# Altium project digital_power.PrjPcb (part 1 of 2)
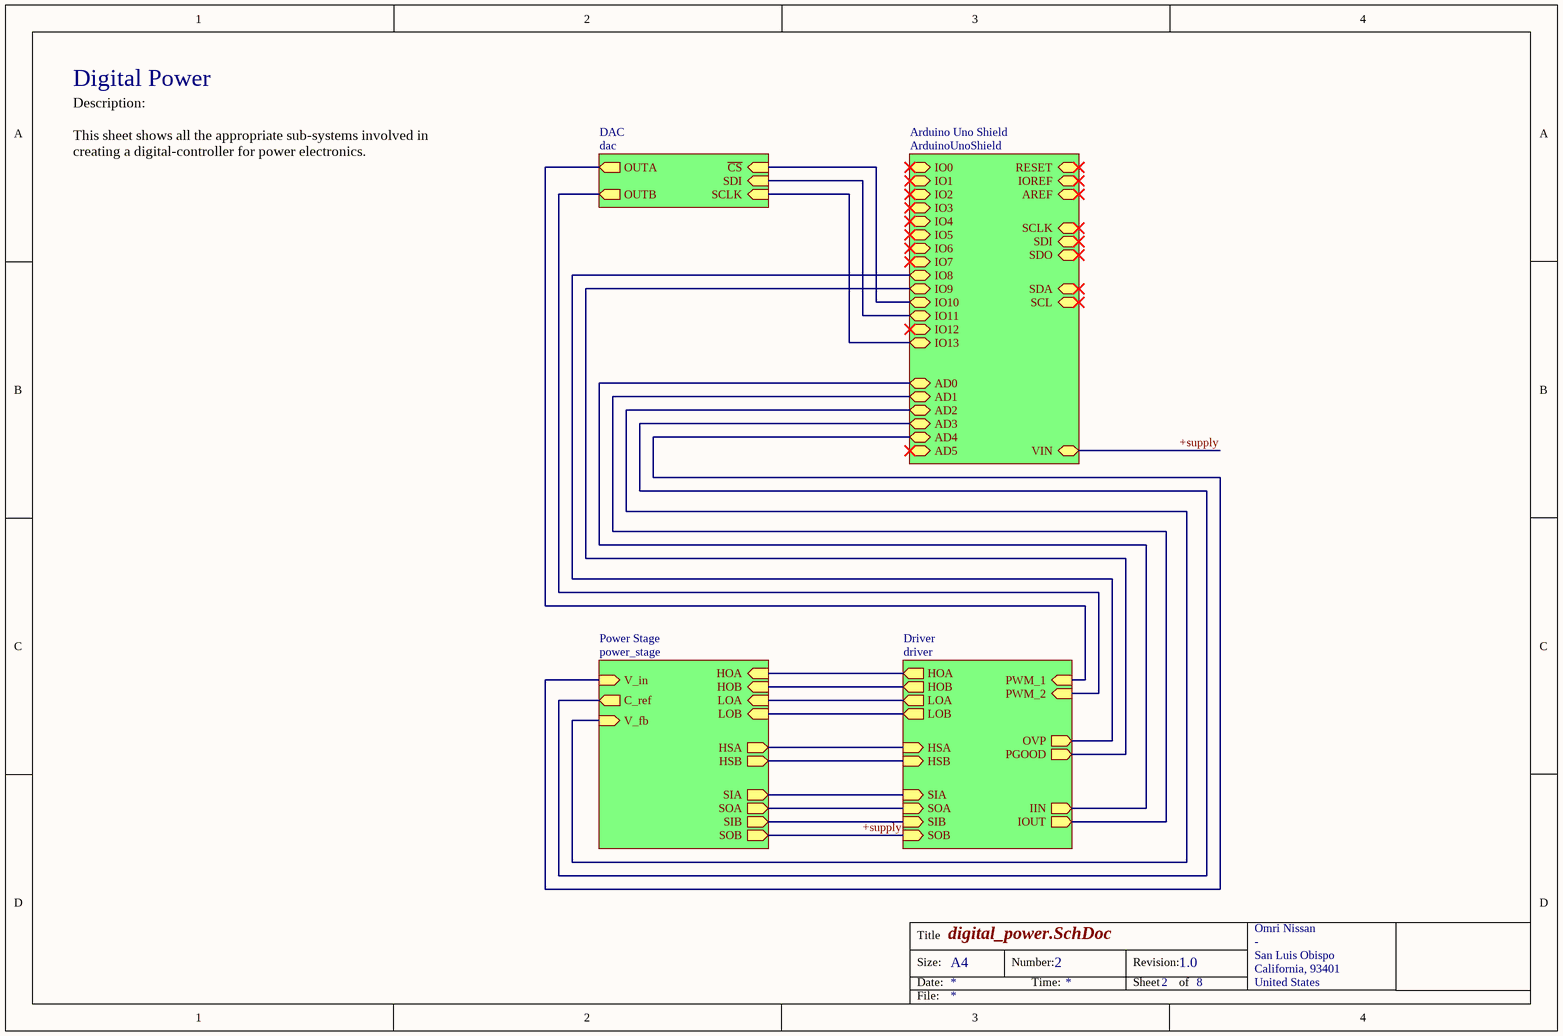
[diagram p0: digital_power.SchDoc]
address1: San Luis Obispo; DrawnBy: Omri Nissan; revision: 1.0
8 sheets, 99 parts. Net scope: hierarchical (ports join the sheet entries above them; power ports are global).
Board file: digital_power.PcbDoc
Sheets:
  digital_power.SchDoc
    Power Stage = power_stage.SchDoc
    Arduino Uno Shield = ArduinoUnoShield.SchDoc
    Driver = driver.SchDoc
      PWM Generator = pwm_generator.SchDoc
      Gate Driver = gate_driver.SchDoc
      PWM Generator = pwm_generator.SchDoc
    DAC = dac.SchDoc
  cover_page.SchDoc

## Sheet digital_power.SchDoc
size A4; Author: Omri Nissan; Organization: Altium Limited; Address1: -; Address2: San Luis Obispo; Address3: California, 93401; Address4: United States; DocumentNumber: 2; SheetNumber: 2; SheetTotal: 8

### Sub-sheets
Arduino Uno Shield = ArduinoUnoShield: AD2 (bidir), IO8 (bidir), SCL (bidir), SCLK (bidir), IO6 (bidir), IO0 (bidir), IO4 (bidir), AD0 (bidir), AD4 (bidir), IOREF (bidir), IO13 (bidir), IO10 (bidir), IO3 (bidir), SDO (bidir), IO1 (bidir), AREF (bidir), AD1 (bidir), AD3 (bidir), SDI (bidir), IO2 (bidir), IO5 (bidir), IO7 (bidir), IO11 (bidir), IO12 (bidir), SDA (bidir), RESET (bidir), IO9 (bidir), AD5 (bidir), VIN (bidir)
DAC = dac: OUTA (out), SCLK (in), ~{CS} (in), SDI (in), OUTB (out)
Driver = driver: OVP (out), PWM_2 (in), HSA (in), HSB (in), HOA (out), LOA (out), IOUT (out), HOB (out), IIN (out), LOB (out), PWM_1 (in), PGOOD (out), SOA (in), SIB (in), SOB (in), SIA (in)
Power Stage = power_stage: V_fb (in), HSA (out), HSB (out), LOA (in), LOB (in), HOB (in), HOA (in), C_ref (out), SIA (out), SIB (out), SOA (out), SOB (out), V_in (in)

### Nets
+supply: sheet Power Stage/SOB, sheet Arduino Uno Shield/VIN, sheet Driver/SOB
MOSI: sheet Arduino Uno Shield/IO11, sheet DAC/SDI
OVP: sheet Arduino Uno Shield/IO8, sheet Driver/OVP
PGOOD: sheet Arduino Uno Shield/IO9, sheet Driver/PGOOD
SA_N: sheet Power Stage/SOA, sheet Driver/SOA
SA_P: sheet Power Stage/SIA, sheet Driver/SIA
SB_P: sheet Power Stage/SIB, sheet Driver/SIB
SCK: sheet Arduino Uno Shield/IO13, sheet DAC/SCLK
NetAD1_1: sheet Arduino Uno Shield/AD0, sheet Driver/IIN
NetAD1_2: sheet Arduino Uno Shield/AD1, sheet Driver/IOUT
NetAD1_3: sheet Power Stage/V_fb, sheet Arduino Uno Shield/AD2
NetAD1_4: sheet Power Stage/C_ref, sheet Arduino Uno Shield/AD3
NetAD1_5: sheet Power Stage/V_in, sheet Arduino Uno Shield/AD4
NetC2_2: sheet Power Stage/HSA, sheet Driver/HSA
NetC3_2: sheet Power Stage/HSB, sheet Driver/HSB
NetIOH1_3: sheet Arduino Uno Shield/IO10, sheet DAC/~{CS}
NetQ1_4: sheet Power Stage/HOA, sheet Driver/HOA
NetQ2_4: sheet Power Stage/HOB, sheet Driver/HOB
NetQ3_4: sheet Power Stage/LOA, sheet Driver/LOA
NetQ4_4: sheet Power Stage/LOB, sheet Driver/LOB
NetTP17_PWM_Generator1_1: sheet Driver/PWM_2, sheet DAC/OUTB
NetTP17_PWM_Generator2_1: sheet Driver/PWM_1, sheet DAC/OUTA

### Notes on the sheet
- Digital Power
- Description:
  This sheet shows all the appropriate sub-systems involved in creating a digital-controller for power electronics.
- Title
- Size:
- Date:
- A4
- Number:
- Time:
- Revision:
- Sheet
- of
- File:

## Sheet power_stage.SchDoc
size A4; Author: Omri Nissan; Organization: Altium Limited; Address1: -; Address2: San Luis Obispo; Address3: California, 93401; Address4: United States; DocumentNumber: 4; SheetNumber: 4; SheetTotal: 8
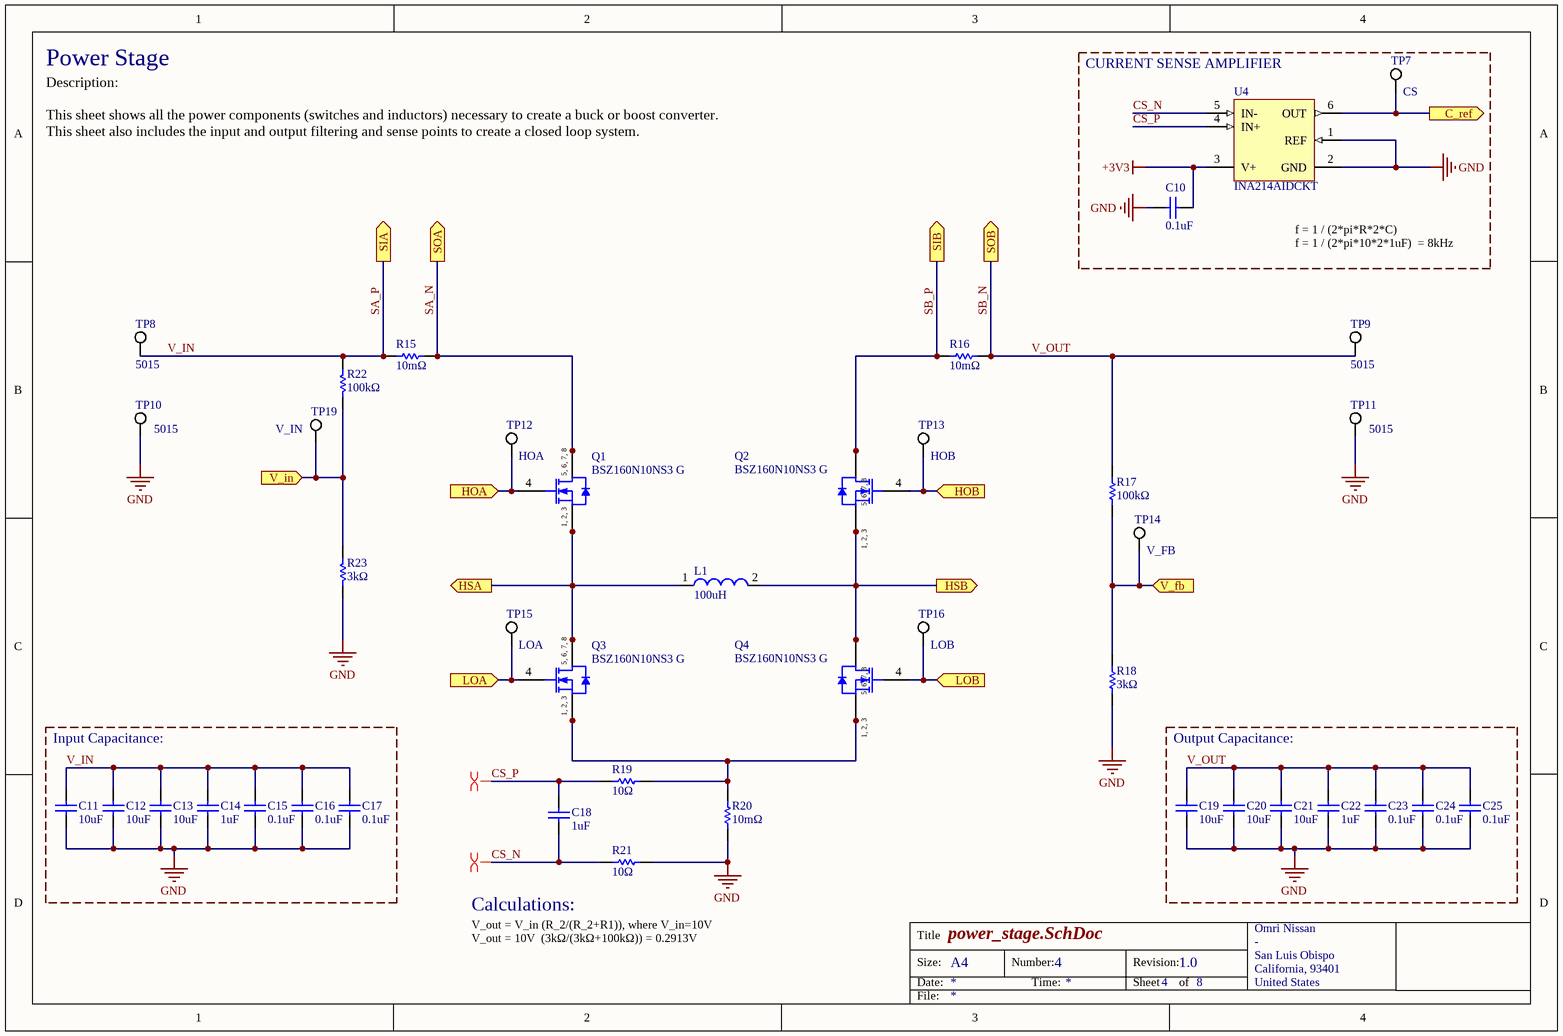
[diagram p1: power_stage.SchDoc]

### Parts
C10  0.1uF  [CAPC1608X90X35ML10T15]
C11  10uF  [CAPC3216X180X20LL20]
C12  10uF  [CAPC3216X180X20LL20]
C13  10uF  [CAPC3216X180X20LL20]
C14  1uF  [CAPC1608X90X20LL10]
C15  0.1uF  [CAPC1608X90X35ML10T15]
C16  0.1uF  [CAPC1608X90X35ML10T15]
C17  0.1uF  [CAPC1608X90X35ML10T15]
C18  1uF  [CAPC1608X90X20LL10]
C19  10uF  [CAPC3216X180X20LL20]
C20  10uF  [CAPC3216X180X20LL20]
C21  10uF  [CAPC3216X180X20LL20]
C22  1uF  [CAPC1608X90X20LL10]
C23  0.1uF  [CAPC1608X90X35ML10T15]
C24  0.1uF  [CAPC1608X90X35ML10T15]
C25  0.1uF  [CAPC1608X90X35ML10T15]
L1  100uH  [WE-PD-XXL]
Q1  BSZ160N10NS3 G  [INF-PG-TSDSON-8-1_V]
Q2  BSZ160N10NS3 G  [INF-PG-TSDSON-8-1_V]
Q3  BSZ160N10NS3 G  [INF-PG-TSDSON-8-1_V]
Q4  BSZ160N10NS3 G  [INF-PG-TSDSON-8-1_V]
R15  10mΩ  [RESC3216X70X50NL05T20]
R16  10mΩ  [RESC3216X70X50NL05T20]
R17  100kΩ  [RESC1608X55X30ML20T20]
R18  3kΩ  [RESC1608X55X25ML10T15]
R19  10Ω  [RESC1609X50X30NL10T20]
R20  10mΩ  [RESC3216X70X50NL05T20]
R21  10Ω  [RESC1609X50X30NL10T20]
R22  100kΩ  [RESC1608X55X30ML20T20]
R23  3kΩ  [RESC1608X55X25ML10T15]
TP7  CS  [KSTN-5012_V]
TP8  5015  [KSTN-5015_V]
TP9  5015  [KSTN-5015_V]
TP10  5015  [KSTN-5015_V]
TP11  5015  [KSTN-5015_V]
TP12  HOA  [KSTN-5012_V]
TP13  HOB  [KSTN-5012_V]
TP14  V_FB  [KSTN-5012_V]
TP15  LOA  [KSTN-5012_V]
TP16  LOB  [KSTN-5012_V]
TP19  V_IN  [KSTN-5012_V]
U4  INA214AIDCKT  [DCK0006A_L]

### Blocks framed on the sheet
CURRENT SENSE AMPLIFIER: C10 TP7 U4
Input Capacitance:: C11-C17
Output Capacitance:: C19-C25

### Ports
C_ref (out), HOA (in), HOB (in), HSA (out), HSB (out), LOA (in), LOB (in), SIA (out), SIB (out), SOA (out), SOB (out), V_fb (in), V_in (in)

### Nets
+3V3: C10.1 U4.3(V+)
GND: C10.2 C11.1 C12.1 C13.1 C14.2 C15.1 C16.1 C17.1 C19.1 C20.1 C21.1 C22.2 C23.1 C24.1 C25.1 R18.1 R20.1 R21.2 R23.1 TP10.1 TP11.1 U4.1(REF) U4.2(GND)
CS_N: C18.2 R21.1 U4.5(IN-)
CS_P: C18.1 R19.1 U4.4(IN+)
SA_N: Q1.5(DRAIN) Q1.6(DRAIN) Q1.7(DRAIN) Q1.8(DRAIN) R15.2 ; port SOA
SA_P: C11.2 C12.2 C13.2 C14.1 C15.2 C16.2 C17.2 R15.1 R22.2 TP8.1 ; port SIA  [also labelled V_IN]
SB_N: C19.2 C20.2 C21.2 C22.1 C23.2 C24.2 C25.2 R16.2 R17.2 TP9.1 ; port SOB  [also labelled V_OUT]  [project net +supply]
SB_P: Q2.5(DRAIN) Q2.6(DRAIN) Q2.7(DRAIN) Q2.8(DRAIN) R16.1 ; port SIB
NetAD1_3: R17.1 R18.2 TP14.1 ; port V_fb
NetAD1_4: TP7.1 U4.6(OUT) ; port C_ref
NetAD1_5: R22.1 R23.2 TP19.1 ; port V_in
NetC2_2: L1.1 Q1.1(SOURCE) Q1.2(SOURCE) Q1.3(SOURCE) Q3.5(DRAIN) Q3.6(DRAIN) Q3.7(DRAIN) Q3.8(DRAIN) ; port HSA
NetC3_2: L1.2 Q2.1(SOURCE) Q2.2(SOURCE) Q2.3(SOURCE) Q4.5(DRAIN) Q4.6(DRAIN) Q4.7(DRAIN) Q4.8(DRAIN) ; port HSB
NetQ1_4: Q1.4(GATE) TP12.1 ; port HOA
NetQ2_4: Q2.4(GATE) TP13.1 ; port HOB
NetQ3_1: Q3.1(SOURCE) Q3.2(SOURCE) Q3.3(SOURCE) Q4.1(SOURCE) Q4.2(SOURCE) Q4.3(SOURCE) R19.2 R20.2
NetQ3_4: Q3.4(GATE) TP15.1 ; port LOA
NetQ4_4: Q4.4(GATE) TP16.1 ; port LOB

### Layout directives
differential pair: CS_N, CS_P

### Notes on the sheet
- Power Stage
- Description:
  This sheet shows all the power components (switches and inductors) necessary to create a buck or boost converter. This sheet also includes the input and output filtering and sense points to create a closed loop system.
- f = 1 / (2*pi*R*2*C)
  f = 1 / (2*pi*10*2*1uF)  = 8kHz
- (near R21) Calculations:
- V_out = V_in (R_2/(R_2+R1)), where V_in=10V
  V_out = 10V  (3kΩ/(3kΩ+100kΩ)) = 0.2913V
- Title
- Size:
- Date:
- A4
- Number:
- Time:
- Revision:
- Sheet
- of
- File:
- (in symbol CMP-1091-00308-1) 5, 6, 7, 8; 1, 2, 3

### Library data of the parts
C10 C15-C17 C23-C25 = CMP-2100-03643-1: GRM188R71H104KA93D - Chip Capacitor, 0.1 uF, +/- 10%, 50 V, -55 to 125 degC, 0603 (1608 Metric), RoHS, Tape and Reel; Manufacturer: Murata; Dielectric Material: Ceramic; Voltage Rating: 50V; Capacitance: 100nF; Dielectric: X7R; Insulation Resistance: 10GR; Case Code (Metric): 1608; Lead Free: LeadFree; Depth: 0.8mm; Number of Pins: 2; Radiation Hardening: No; Case/Package: 0603; Manufacturer URL: http://www.murata.com/; Packaging: TapeandReel; Length: 1.6mm; Contact Plating: Tin; Datasheet URL: http://psearch.en.murata.com/capacitor/product/GRM188R71H104KA93%23.pdf; Tolerance: 10%; Case Code (Imperial): 0603; Min Operating Temperature: -55degC; RoHSCompliant: true; Voltage: 50V; Termination: SMD/SMT; Mount: SurfaceMount; Material: Ceramic; Package Quantity: 1; Height: 0.8mm; Thickness: 0.035inch; REACH SVHC: NoSVHC; Max Operating Temperature: 125degC; Width: 0.8mm; Package Reference: 0603; Voltage Rating (DC): 50V; Datasheet Version: 42675.0; Package Description: 2-Pin Surface Mount Device, Body 1.6 x 0.8 mm
C11-C13 C19-C21 = CMP-2000-06045-1: C3216X5R1H106K160AB - Chip Capacitor, 10 uF, +/- 10%, 50 V, -55 to 85 degC, 1206 (3216 Metric), RoHS, Tape and Reel; Manufacturer: TDK; PCN Part Number: MLCCPartNumberChange30/Nov/2012; Temperature Coefficient: X5R; Catalog Drawings: CSERIES_1206_1.8; Capacitance: 10µF; Product Training Modules: CSeriesGeneralApplicationsSEAT,CCV,andTVCLDesignToolsGuidetoReplacinganElectrolyticCapacitorwithanMLCC; Voltage - Rated: 50V; Other Names: 445-5998-6; Online Catalog: CSeries,GeneralPurpose; Family: CeramicCapacitors; Package URL: https://product.tdk.com/info/en/documents/chara_sheet/C3216X7R1V106K160AC.pdf; Height - Seated (Max): -; RoHS Information: RoHSCertificate-MLCC; Ratings: -; Series: C; Applications: GeneralPurpose; Thickness (Max): 0.071"(1.80mm); Manufacturer URL: http://www.tdk.com/; Standard Package: 1; Operating Temperature: -55°C~85°C; Tolerance: ±10%; Datasheet URL: https://product.tdk.com/info/en/catalog/datasheets/mlcc_commercial_general_en.pdf; Package / Case: 1206(3216Metric); Package Description: 2-Pin Surface Mount Device, Body 3.2 x 1.6 mm; Size / Dimension: 0.126"Lx0.063"W(3.20mmx1.60mm); Mounting Technology: SurfaceMount; Packaging: Digi-Reel®; Category: Capacitors; Package Reference: 1206; Mounting Type: SurfaceMount,MLCC; Datasheet Version: 08/2016; Lead Style: -; Features: -; Lead Spacing: -
C14 C18 C22 = CMP-2000-06025-1: C1608X5R1H105K080AB- Chip Capacitor, 1 uF, +/- 10%, 50 V, -55 to 85 degC, 0603 (1608 Metric), RoHS, Tape and Reel; Manufacturer: TDK; PCN Part Number: MLCCPartNumberChange30/Nov/2012; Other Names: 445-7468-6; Online Catalog: CSeries,GeneralPurpose; Capacitance: 1µF; Product Training Modules: CSeriesGeneralApplicationsSEAT,CCV,andTVCLDesignToolsGuidetoReplacinganElectrolyticCapacitorwithanMLCC; Voltage - Rated: 50V; Design Resources: 20WNon-IsolatedBuckLEDDriverUsingPLLNK460KG; Temperature Coefficient: X5R; Series: C; Datasheet Version: 08/2016; Package Description: 2-Pin Surface Mount Device, Body 1.6 x 0.8 mm; Mounting Technology: SurfaceMount; Features: -; Size / Dimension: 0.063"Lx0.031"W(1.60mmx0.80mm); Lead Spacing: -; Operating Temperature: -55°C~85°C; Tolerance: ±10%; Height - Seated (Max): -; Mounting Type: SurfaceMount,MLCC; Ratings: -; Standard Package: 1; Applications: GeneralPurpose; Datasheet URL: https://product.tdk.com/info/en/catalog/datasheets/mlcc_commercial_general_en.pdf; Category: Capacitors; Lead Style: -; Packaging: Digi-Reel®; RoHS Information: RoHSCertificate-MLCC; Package / Case: 0603(1608Metric); Package Reference: 0603; Manufacturer URL: http://www.tdk.com/; Thickness (Max): 0.035"(0.90mm); Family: CeramicCapacitors
L1 = CMP-0227-00035-1: 7447709101 - SMD-Shielded Power Inductor WE-PD, L = 100 µH; Inductance: 100 ÂµH; ComponentLink2Description: Datasheet; DatasheetVersion: ver 1, Oct-2004; PackageDescription: SMD Inductor, 2-Leads, Body 12.0 x 12.0 mm; ComponentLink1URL: http://www.we-online.com; PackageVersion: 2004; PackageReference: WE-PD-XXL; ComponentLink2URL: http://www.we-online.de/katalog/media/pdf/7447709101.pdf; ComponentLink1Description: Manufacturer Link
Q1-Q4 = CMP-1091-00308-1: N-Channel OptiMOS 3 Power-Transistor, 100 V VDS, 40 A ID, -55 to 150 degC, PG-TSDSON-8-1, Reel, Green; Manufacturer: Infineon; VGS(th) (min): 2Â V; VDS (max): 100Â V; IDpuls (max): 160Â A; Ptot (max): 63Â W; RthJC (max): 2.1Â K/W; RthJA (max): 62 K/W; ID (max): 40Â A; RDS (on) (max): 16Â mOhm; VGS(th) (max): 3.5Â V; QG: 19Â nC; Green: TRUE; Polarity: N; Halogen-free: TRUE; ComponentLink3URL: http://www.infineon.com/dgdl/BSZ240N12NS3+Rev2.0.pdf?folderId=db3a304313b8b5a60113cee8763b02d7&fileId=db3a30432a40a650012a42f3057a0038; PackageReference: PG-TSDSON-8-1; PartNumber: BSZ160N10NS3 G; Packing: Reel; Mounting Technology: Surface Mount; Rth: 2.1Â K/W; PackageVersion: Rev. 02, 09/2008; DatasheetVersion: Rev. 1.2; ComponentLink3Description: Package Specification; ComponentLink2URL: http://www.infineon.com/dgdl/BSZ160N10N3SG_rev1.2.pdf?folderId=db3a304313b8b5a60113cee8763b02d7&fileId=db3a304320896aa20120c3365eef2370; ComponentLink1Description: Manufacturer URL; ComponentLink2Description: Datasheet; ComponentLink1URL: http://www.infineon.com/; PackageDescription: 8-Pin Plastic (Green) Thin Dual Small Outline Non-Leaded Package, 3.3 x 3.3 mm Body, 0.65 mm Pitch
R15 R16 R20 = CMP-2003-00786-1: ERJ8CWFR010V; Manufacturer: Panasonic; Part Number: ERJ8CWFR010V
R17 R22 = CMP-2000-00875-1: ERA3AEB104V; Manufacturer: Panasonic; Part Number: ERA3AEB104V
R18 R23 = CMP-2000-04454-1: RT0603BRD073KL; Manufacturer: Yageo; Part Number: RT0603BRD073KL
R19 R21 = CMP-2000-03849-1: CRCW060310R0JNEA; Manufacturer: Vishay Dale; Part Number: CRCW060310R0JNEA
TP7 TP12-TP16 TP19 = CMP-1672-00004-4: Test Point, White, Through Hole, RoHS, Bulk; Manufacturer: Keystone; DatasheetVersion: Rev. F, 12/2013; ComponentLink1URL: http://www.keyelco.com/; PackageReference: 5012; RoHSCompliant: true; ComponentLink2Description: Datasheet; Colour: White; Contact Material: Bronze; PackageDescription: 1-Pin Through Hole Device, Dia 3.17 mm; Mounting Technology: Through Hole; Mount: Through Hole; Package Quantity: 100; ComponentLink1Description: Manufacturer URL; Pins: 1; Height: 8.12 mm; Packaging: Bulk; REACH SVHC: No SVHC; Contact Plating: Silver; Length: 11.3 mm; ComponentLink2URL: http://www.keyelco.com/product-pdf.cfm?p=1321
TP8-TP11 = CMP-2000-05183-1: Test Point, White, SMT; Manufacturer: Keystone; Primary Type: PCBTestPoints; Style: Miniature; Finish Plating: SilverPlate; Material, Contact: PhosphorBronze; Material: PhosphorBronze; Datasheet URL: https://datasheet.ciiva.com/1123/5015-1123862.pdf; Thickness: 0.010In.; Manufacturer URL: http://www.keyelco.com/; Length: 0.105"(2.667mm); Datasheet Version: Mar-14; Contact Plating: Silver; Mounting Type: SurfaceMount; Termination: SMT; Type: TestPointsonTapeandReel; Height: 0.06In.; Mounting: SurfaceMount
U4 = CMP-2000-06456-1: Voltage Output, High / Low-Side Measurement, Bi-Directional Zero-Drift Series, Current Shunt Monitor, 2.7 to 26 V, -40 to 125 degC, 6-Pin SOT-23 (DCK6), Green (RoHS & no Sb/Br), Tape and Reel; Package Version: 4093553-4/G, 01/2007; Development Kit: INA210-214EVM; Unit Weight: 0.000088oz; Vcm - Common Mode Voltage: -0.3Vto+26V; Gain V/V: 100V/V; Operating Supply Current: 115uA; Topology: CurrentShuntFeedback; Number of Channels: 1Channel; Accuracy: 1%; Amplifier Type: CurrentSense; Gain Error: 0.02%; Vos - Input Offset Voltage: 60uV; Brand: TexasInstruments; Supply Voltage - Max: 26V; CMRR - Common Mode Rejection Ratio: 105dB; Supply Voltage - Min: 2.7V; GBP - Gain Bandwidth Product: 30kHz; Product Category: CurrentSenseAmplifiers; Series: INA214; Mounting Style: SMD/SMT; Datasheet URL: http://www.ti.com/lit/gpn/INA214?keyMatch=INA214AIDCKT&tisearch=Search-EN-Everything; Maximum Operating Temperature: +125C; Package / Case: SOT-23-6; Minimum Operating Temperature: -40C; Datasheet Version: Rev. G, 07/2014; RoHS: True; Manufacturer URL: http://www.ti.com/; Package Description: 6-Pin Plastic Small Outline, Body 2 x 1.25 mm, Pitch 0.65 mm; Product: CurrentSenseAmplifiers; Package Reference: DCK6; Packaging: Reel; Manufacturer: TexasInstruments; Mounting Technology: SurfaceMount

## Sheet ArduinoUnoShield.SchDoc
size A4; Author: Omri Nissan; Organization: Altium Limited; Address1: -; Address2: San Luis Obispo; Address3: California, 93401; Address4: United States; DocumentNumber: 3; SheetNumber: 3; SheetTotal: 8
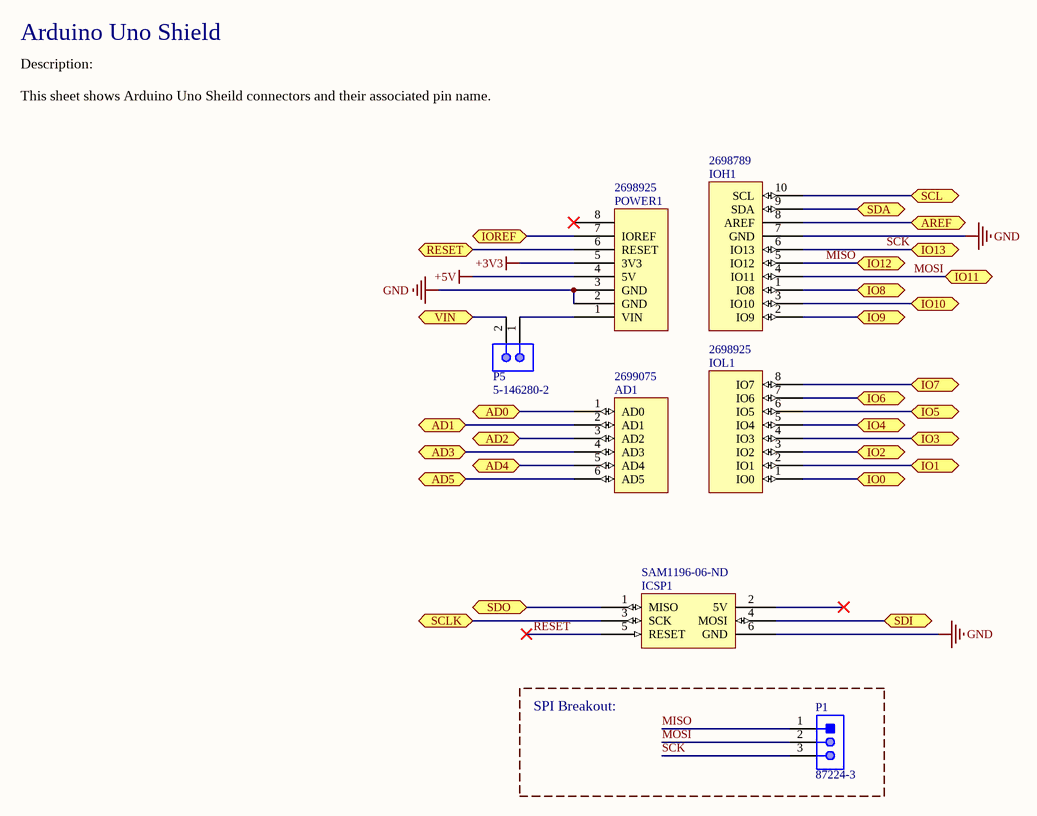
[diagram p2: ArduinoUnoShield.SchDoc]

### Parts
AD1  Supplier Part Number 4: 2699075  [Header 6x1 8.5mm]  (hidden comment: AD)
ICSP1  Supplier Part Number 5: SAM1196-06-ND  [ICSP]  (hidden comment: ICSP)
IOH1  Supplier Part Number 3: 2698789  [Header 10x1 8.5mm]  (hidden comment: IOH)
IOL1  Supplier Part Number 4: 2698925  [Header 8x1 8.5mm]  (hidden comment: IOL)
P1  87224-3  [TECO-87224-3_V]
P5  5-146280-2  [TECO-5-146280-2_V]
POWER1  Supplier Part Number 4: 2698925  [Header 8x1 8.5mm]  (hidden comment: POWER_UNO)

### Blocks framed on the sheet
SPI Breakout:: P1

### Ports
AD0 (bidir), AD1 (bidir), AD2 (bidir), AD3 (bidir), AD4 (bidir), AD5 (bidir), AREF (bidir), IO0 (bidir), IO1 (bidir), IO2 (bidir), IO3 (bidir), IO4 (bidir), IO5 (bidir), IO6 (bidir), IO7 (bidir), IO8 (bidir), IO9 (bidir), IO10 (bidir), IO11 (bidir), IO12 (bidir), IO13 (bidir), IOREF (bidir), RESET (bidir), SCL (bidir), SCLK (bidir), SDA (bidir), SDI (bidir), SDO (bidir), VIN (bidir)

### Nets
+3V3: POWER1.5(3V3)
+5V: POWER1.4(5V)
GND: ICSP1.6(GND) IOH1.7(GND) POWER1.2(GND) POWER1.3(GND)
+supply: P5.2 ; port VIN
MISO: IOH1.5(IO12) P1.1 ; port IO12
MOSI: IOH1.4(IO11) P1.2 ; port IO11
OVP: IOH1.1(IO8) ; port IO8
PGOOD: IOH1.2(IO9) ; port IO9
RESET: ICSP1.5(RESET)
SCK: IOH1.6(IO13) P1.3 ; port IO13
NetAD1_1: AD1.1(AD0) ; port AD0
NetAD1_2: AD1.2(AD1) ; port AD1
NetAD1_3: AD1.3(AD2) ; port AD2
NetAD1_4: AD1.4(AD3) ; port AD3
NetAD1_5: AD1.5(AD4) ; port AD4
NetAD1_6: AD1.6(AD5) ; port AD5
NetICSP1_1: ICSP1.1(MISO) ; port SDO
NetICSP1_3: ICSP1.3(SCK) ; port SCLK
NetICSP1_4: ICSP1.4(MOSI) ; port SDI
NetIOH1_3: IOH1.3(IO10) ; port IO10
NetIOH1_8: IOH1.8(AREF) ; port AREF
NetIOH1_9: IOH1.9(SDA) ; port SDA
NetIOH1_10: IOH1.10(SCL) ; port SCL
NetIOL1_1: IOL1.1(IO0) ; port IO0
NetIOL1_2: IOL1.2(IO1) ; port IO1
NetIOL1_3: IOL1.3(IO2) ; port IO2
NetIOL1_4: IOL1.4(IO3) ; port IO3
NetIOL1_5: IOL1.5(IO4) ; port IO4
NetIOL1_6: IOL1.6(IO5) ; port IO5
NetIOL1_7: IOL1.7(IO6) ; port IO6
NetIOL1_8: IOL1.8(IO7) ; port IO7
NetP5_1: P5.1 POWER1.1(VIN)
NetPOWER1_6: POWER1.6(RESET) ; port RESET
NetPOWER1_7: POWER1.7(IOREF) ; port IOREF

Not connected (* = marked no-connect by the designer): ICSP1 2(5V)*; POWER1 8*

### Notes on the sheet
- Arduino Uno Shield
- Description:
  This sheet shows Arduino Uno Sheild connectors and their associated pin name.
- Title
- Size:
- Date:
- A4
- Number:
- Time:
- Revision:
- Sheet
- of
- File:

### Library data of the parts
P1 = CMP-2000-05697-1: Male Header, Pitch 2.54 mm, 1 x 3 Position, Height 10.744 mm, Tail Length 3.175 mm, -65 to 105 degC, RoHS, Bulk; Manufacturer: TE Connectivity; Catalog Drawings: SingleSquareStraightPost / SingleSquareStraightPostSide; Connector Type: Header,Unshrouded; Pitch: 0.100"(2.54mm); Mating Products: 147738-2-ND / -CONNRCPT3POSVERTSMDGOLD / 147723-2-ND / -CONNRCPT3POSVERT.100GOLD / 146763-5-ND / -CONNRCPT3POSSGLVERT.100T/H / A32904-ND / -CONNRECEPT3POS.100VERTGOLD / A26922-ND / -CONNHOUSING3POS.100LOCKING / A26415-ND / -CONNRECEPT3POS.100VERTAU / A26964-ND / -CONNHOUSING3POS.100SINGLE / A3012-ND / -CONNHOUSING3POS.100SINGLE; Number of Positions Loaded: All; Featured Product: AMPMODUConnectors; Dynamic Catalog: AMPMODUModIISeries; 3D Model: 87224-3.pdf; Other Names: 87224-3-ND / A26545; Number of Positions: 3; RoHS Information: 87224-3StatementofCompliance; Termination: Solder; Datasheet URL: http://www.te.com/commerce/DocumentDelivery/DDEController?Action=showdoc&DocId=Customer+Drawing%7F87224%7FL3%7Fpdf%7FEnglish%7FENG_CD_87224_L3.pdf%7F87224-3; Category: Connectors,Interconnects; Contact Mating Length: 0.318"(8.08mm); Standard Package: 520; Mounting Type: ThroughHole; Family: RectangularConnectors-Headers,MalePins; Number of Rows: 1; Series: AMPMODUModII; Contact Finish Thickness: 15µin(0.38µm); Datasheet Version: Rev. L3, 08/2015; Package Reference: 87224-3; Mounting Technology: ThroughHole; Manufacturer URL: http://www.te.com/; Contact Type: MalePin; Packaging: Bulk; Color: Black; Package Description: Male Header, Pitch 2.54 mm, 1 x 3 Position, Height 10.744 mm, Tail Length 3.175 mm; Contact Finish: Gold
P5 = CMP-2000-07492-1: Male Header, Pitch 2.54 mm, 1 x 2 Position, Height 8.21 mm, Tail Length 3.05 mm, -65 to 105 degC, RoHS, Bulk; Manufacturer: TE Connectivity; Mating Connector Lock: No(Without); Number of Positions: 2; Pitch: 2.54mm; PCB Mounting Orientation: Vertical; Keyed: No; Case\/Package: 100; Mating Post Length: 0.23inch; High Temperature Housing: Yes; Max Current Rating: 5A; PCB Thickness: 0.063inch; PCB Mount Retention: Without; Approvals: CSA; Current Rating: 3A; Radiation Hardening: No; Length: 4.67mm; Contact Mating Length: 0.23inch; Connector Type: Header; Number of Rows: 1; Termination Post Length: 0.12inch; Board Standoff: No(Without); Max Operating Temperature: 105degC; Contact Shape: Square; Selectively Loaded: No(Without); Gasket: No(Without); Number of Contacts: 2; Contact Gender: Male; Mating Alignment: No(Without); Manufacturer URL: http://www.te.com/; Datasheet URL: http://www.te.com/commerce/DocumentDelivery/DDEController?Action=showdoc&DocId=Customer+Drawing%7F146280%7FH1%7Fpdf%7FEnglish%7FENG_CD_146280_H1.pdf%7F5-146280-2; Mount: ThroughHole; Orientation: Straight; Packaging: Carton; Package Reference: 5-146280-2; Package Quantity: 500; Stabilizers: No(Without); Row Spacing: 2.54mm; Contact Material: CopperAlloy; Panel Mount Retention: No(Without); Datasheet Version: Rev. H1, 08/2016; Housing Colour: Black; Colour: Black; Package Description: Male Header, Pitch 2.54 mm, 1 x 2 Position, Height 8.21 mm, Tail Length 3.05 mm; Contact Plating: Matte; Housing Material: Polymer; Contact Protection: No(Without); Min Operating Temperature: -65degC; Mounting Technology: ThroughHole; Flammability Rating: UL94V-0; RoHSCompliant: true; Termination: ThroughHole; Depth: 2.34mm; High Speed Serial Data Connector: No
AD1 = AD: Supplier 1: Arrow; Supplier Part Number 1: 2699089; Supplier 2: Digi-Key; Supplier Part Number 2: SAM1198-06-ND; Supplier 3: Arrow; Supplier Part Number 3: 2699088; Supplier 4: Arrow
ICSP1 = ICSP: Supplier 1: Arrow; Supplier Part Number 1: 2699117; Supplier 2: Arrow; Supplier Part Number 2: 2699116; Supplier 3: Digi-Key; Supplier Part Number 3: SAM1185-06-ND; Supplier 4: Arrow; Supplier Part Number 4: 2699091; Supplier 5: Digi-Key
IOH1 = IOH: Supplier 1: Arrow; Supplier Part Number 1: 2698803S4475693N1004; Supplier 2: Digi-Key; Supplier Part Number 2: SAM1198-10-ND; Supplier 3: Arrow
IOL1 = IOL: Supplier 1: Digi-Key; Supplier Part Number 1: SAM1198-08-ND; Supplier 2: Arrow; Supplier Part Number 2: 2698939; Supplier 3: Arrow; Supplier Part Number 3: 2698940; Supplier 4: Arrow
POWER1 = POWER_UNO: Supplier 1: Digi-Key; Supplier Part Number 1: SAM1198-08-ND; Supplier 2: Arrow; Supplier Part Number 2: 2698939; Supplier 3: Arrow; Supplier Part Number 3: 2698940; Supplier 4: Arrow

## Sheet driver.SchDoc
size A4; Author: Omri Nissan; Organization: Altium Limited; Address1: -; Address2: San Luis Obispo; Address3: California, 93401; Address4: United States; DocumentNumber: 5; SheetNumber: 5; SheetTotal: 8
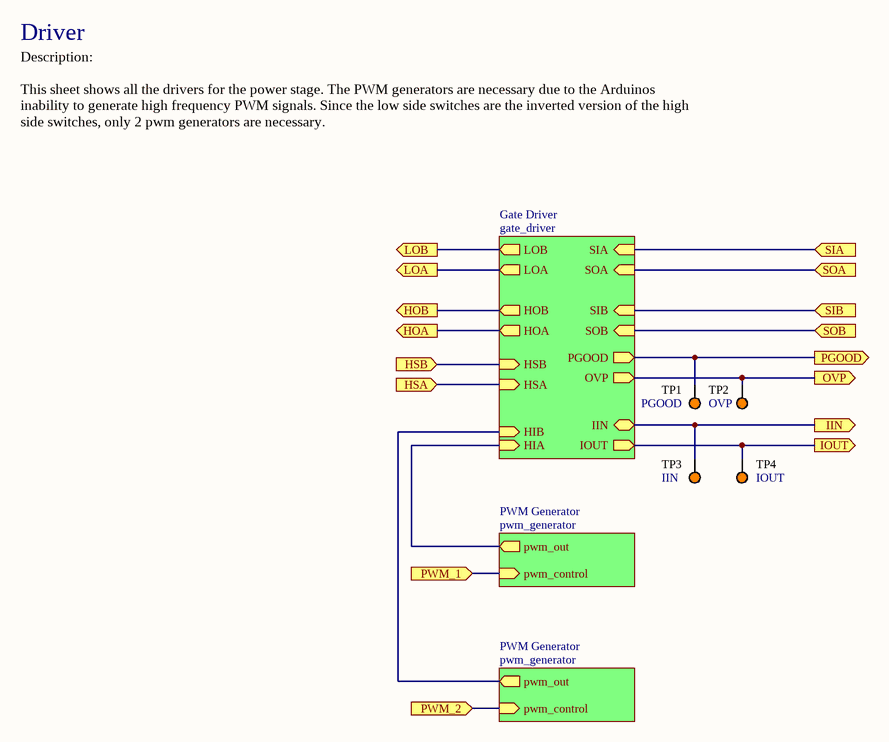
[diagram p3: driver.SchDoc]

### Parts
TP1  PGOOD  [KSTN-5013_V]
TP2  OVP  [KSTN-5013_V]
TP3  IIN  [KSTN-5013_V]
TP4  IOUT  [KSTN-5013_V]

### Sub-sheets
Gate Driver = gate_driver: HOB (out), LOA (out), LOB (out), HOA (out), HSB (in), IOUT (out), OVP (out), HSA (in), HIB (in), HIA (in), PGOOD (out), IIN (bidir), SOB (in), SIB (in), SIA (in), SOA (in)
PWM Generator = pwm_generator: pwm_out (out), pwm_control (in)
PWM Generator = pwm_generator: pwm_out (out), pwm_control (in)

### Ports
HOA (out), HOB (out), HSA (in), HSB (in), IIN (out), IOUT (out), LOA (out), LOB (out), OVP (out), PGOOD (out), PWM_1 (in), PWM_2 (in), SIA (in), SIB (in), SOA (in), SOB (in)

### Nets
+supply: port SOB, sheet Gate Driver/SOB
HIA: sheet PWM Generator/pwm_out, sheet Gate Driver/HIA
HIB: sheet Gate Driver/HIB, sheet PWM Generator/pwm_out
OVP: TP2.1 ; port OVP, sheet Gate Driver/OVP
PGOOD: TP1.1 ; port PGOOD, sheet Gate Driver/PGOOD
SA_N: port SOA, sheet Gate Driver/SOA
SA_P: port SIA, sheet Gate Driver/SIA
SB_P: port SIB, sheet Gate Driver/SIB
NetAD1_1: TP3.1 ; port IIN, sheet Gate Driver/IIN
NetAD1_2: TP4.1 ; port IOUT, sheet Gate Driver/IOUT
NetC2_2: port HSA, sheet Gate Driver/HSA
NetC3_2: port HSB, sheet Gate Driver/HSB
NetQ1_4: port HOA, sheet Gate Driver/HOA
NetQ2_4: port HOB, sheet Gate Driver/HOB
NetQ3_4: port LOA, sheet Gate Driver/LOA
NetQ4_4: port LOB, sheet Gate Driver/LOB
NetTP17_PWM_Generator1_1: port PWM_2, sheet PWM Generator/pwm_control
NetTP17_PWM_Generator2_1: port PWM_1, sheet PWM Generator/pwm_control

### Notes on the sheet
- Driver
- Description:
  This sheet shows all the drivers for the power stage. The PWM generators are necessary due to the Arduinos inability to generate high frequency PWM signals. Since the low side switches are the inverted version of the high side switches, only 2 pwm generators are necessary.
- Title
- Size:
- Date:
- A4
- Number:
- Time:
- Revision:
- Sheet
- of
- File:

### Library data of the parts
TP1-TP4 = CMP-1672-00005-4: Test Point, Orange, Through Hole, RoHS, Bulk; Manufacturer: Keystone; REACH SVHC: No SVHC; ComponentLink2Description: Datasheet; PackageDescription: 1-Pin Through Hole Device, Dia 3.17 mm; Package Quantity: 100; PackageReference: 5013; Contact Material: Bronze; DatasheetVersion: Rev. F, 12/2013; ComponentLink2URL: http://www.keyelco.com/product-pdf.cfm?p=1322; Contact Plating: Silver; ComponentLink1URL: http://www.keyelco.com/; Packaging: Bulk; ComponentLink1Description: Manufacturer URL; Colour: Orange; Height: 8.12 mm; RoHSCompliant: True; Mount: Through Hole; Mounting Technology: Through Hole

## Sheet pwm_generator.SchDoc
size A4; Author: Omri Nissan; Organization: Altium Limited; Address1: -; Address2: San Luis Obispo; Address3: California, 93401; Address4: United States; DocumentNumber: 6; SheetNumber: 6; SheetTotal: 8
Used 2 times, as channels Driver/PWM Generator, Driver/PWM Generator. Parts and nets are listed once, with the designators drawn on the sheet.
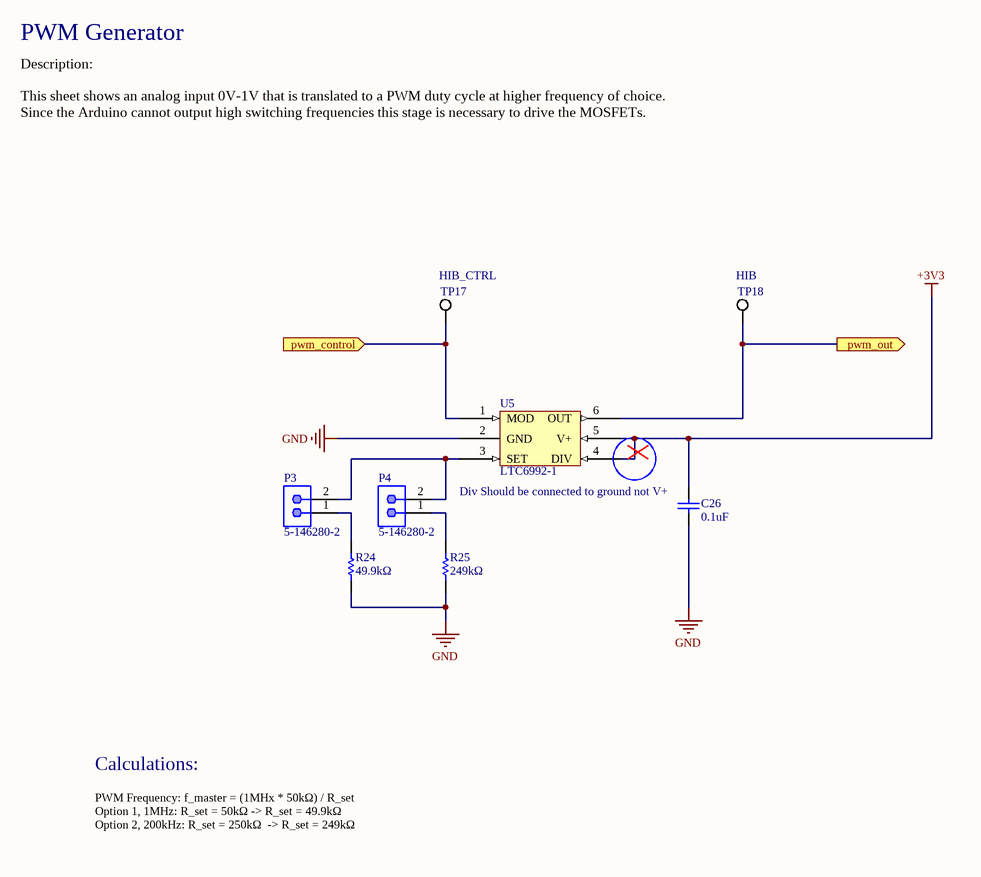
[diagram p4: pwm_generator.SchDoc]

### Parts
C26  0.1uF  [CAPC1608X90X35ML10T15]
P3  5-146280-2  [TECO-5-146280-2_V]
P4  5-146280-2  [TECO-5-146280-2_V]
R24  49.9kΩ  [RESC1609X55X30ML10T20]
R25  249kΩ  [RESC1609X55X30LL10T20]
TP17  HIB_CTRL  [KSTN-5012_V]
TP18  HIB  [KSTN-5012_V]
U5  LTC6992-1  [LT-S6-6-TSOT-23_L]

### Ports
pwm_control (in), pwm_out (out)

### Nets
+3V3: C26.2 U5.4(DIV) U5.5(V+)
GND: C26.1 R24.1 R25.1 U5.2(GND)
pwm_control: TP17.1 U5.1(MOD) ; port pwm_control
pwm_out: TP18.1 U5.6(OUT) ; port pwm_out
NetP3_1: P3.1 R24.2
NetP3_2: P3.2 P4.2 U5.3(SET)
NetP4_1: P4.1 R25.2

### Channels
Driver/PWM Generator: designators C26=C26_2 P3=P3_2 P4=P4_2 R24=R24_2 R25=R25_2 TP17=TP17_PWM_Generator2 TP18=TP18_PWM_Generator2 U5=U5_2; ports pwm_control=NetTP17_PWM_Generator2_1 pwm_out=HIA
Driver/PWM Generator: designators C26=C26_1 P3=P3_1 P4=P4_1 R24=R24_1 R25=R25_1 TP17=TP17_PWM_Generator1 TP18=TP18_PWM_Generator1 U5=U5_1; ports pwm_control=NetTP17_PWM_Generator1_1 pwm_out=HIB

### Notes on the sheet
- PWM Generator
- Description:
  This sheet shows an analog input 0V-1V that is translated to a PWM duty cycle at higher frequency of choice. Since the Arduino cannot output high switching frequencies this stage is necessary to drive the MOSFETs.
- (near C26) Div Should be connected to ground not V+
- Calculations:
- PWM Frequency: f_master = (1MHx * 50kΩ) / R_set
  Option 1, 1MHz: R_set = 50kΩ -> R_set = 49.9kΩ
  Option 2, 200kHz: R_set = 250kΩ  -> R_set = 249kΩ
- Title
- Size:
- Date:
- A4
- Number:
- Time:
- Revision:
- Sheet
- of
- File:

### Library data of the parts
C26 = CMP-2100-03643-1: as C10 on sheet power_stage; Case Code (Metric): 1608; Lead Free: LeadFree; Depth: 0.8mm; Number of Pins: 2; Radiation Hardening: No; Case/Package: 0603; Manufacturer URL: http://www.murata.com/; Packaging: TapeandReel; Length: 1.6mm; Contact Plating: Tin; Datasheet URL: http://psearch.en.murata.com/capacitor/product/GRM188R71H104KA93%23.pdf; Tolerance: 10%; Case Code (Imperial): 0603; Min Operating Temperature: -55degC; RoHSCompliant: true; Voltage: 50V; Termination: SMD/SMT; Mount: SurfaceMount; Material: Ceramic; Package Quantity: 1; Height: 0.8mm; Thickness: 0.035inch; REACH SVHC: NoSVHC; Max Operating Temperature: 125degC; Width: 0.8mm; Package Reference: 0603; Voltage Rating (DC): 50V; Datasheet Version: 42675.0; Package Description: 2-Pin Surface Mount Device, Body 1.6 x 0.8 mm
P3 P4 = CMP-2000-07492-1: as P5 on sheet ArduinoUnoShield; Radiation Hardening: No; Length: 4.67mm; Contact Mating Length: 0.23inch; Connector Type: Header; Number of Rows: 1; Termination Post Length: 0.12inch; Board Standoff: No(Without); Max Operating Temperature: 105degC; Contact Shape: Square; Selectively Loaded: No(Without); Gasket: No(Without); Number of Contacts: 2; Contact Gender: Male; Mating Alignment: No(Without); Manufacturer URL: http://www.te.com/; Datasheet URL: http://www.te.com/commerce/DocumentDelivery/DDEController?Action=showdoc&DocId=Customer+Drawing%7F146280%7FH1%7Fpdf%7FEnglish%7FENG_CD_146280_H1.pdf%7F5-146280-2; Mount: ThroughHole; Orientation: Straight; Packaging: Carton; Package Reference: 5-146280-2; Package Quantity: 500; Stabilizers: No(Without); Row Spacing: 2.54mm; Contact Material: CopperAlloy; Panel Mount Retention: No(Without); Datasheet Version: Rev. H1, 08/2016; Housing Colour: Black; Colour: Black; Package Description: Male Header, Pitch 2.54 mm, 1 x 2 Position, Height 8.21 mm, Tail Length 3.05 mm; Contact Plating: Matte; Housing Material: Polymer; Contact Protection: No(Without); Min Operating Temperature: -65degC; Mounting Technology: ThroughHole; Flammability Rating: UL94V-0; RoHSCompliant: true; Termination: ThroughHole; Depth: 2.34mm; High Speed Serial Data Connector: No
R24 = CMP-2000-03773-1: TNPW060349K9BEEN; Manufacturer: Vishay Dale; Part Number: TNPW060349K9BEEN
R25 = CMP-2000-03736-1: TNPW0603249KBEEA; Manufacturer: Vishay Dale; Part Number: TNPW0603249KBEEA
TP17 TP18 = CMP-1672-00004-4: as TP7 on sheet power_stage; DatasheetVersion: Rev. F, 12/2013; ComponentLink1URL: http://www.keyelco.com/; PackageReference: 5012; RoHSCompliant: true; ComponentLink2Description: Datasheet; Colour: White; Contact Material: Bronze; PackageDescription: 1-Pin Through Hole Device, Dia 3.17 mm; Mounting Technology: Through Hole; Mount: Through Hole; Package Quantity: 100; ComponentLink1Description: Manufacturer URL; Pins: 1; Height: 8.12 mm; Packaging: Bulk; REACH SVHC: No SVHC; Contact Plating: Silver; Length: 11.3 mm; ComponentLink2URL: http://www.keyelco.com/product-pdf.cfm?p=1321
U5 = LTC6992-1: Oscillator, Silicon IC 3.81Hz ~ 1MHz TSOT-23-6; Manufacturer 1: Analog Devices; Manufacturer Part Number 1: LTC6992IS6-1#TRMPBF; Operating Supply Current: 365uA; Supplier 1: Digi-Key; Stock 1: 9940; Pricing 1: 1=4.57000, 25=3.03440, 100=2.50910, 250=2.38364 (USD); Mount: Surface Mount; Case/Package: SOT-23-6; Number of Pins: 23; Min Operating Temperature: -40°C; Max Operating Temperature: 85°C; Packaging: Tape and Reel; Package Quantity: 500; Frequency: 3.81Hz; Length: 2.9mm; Depth: 1.75mm; Radiation Hardening: No; Lead Free: Lead Free; ComponentLink1URL: https://datasheet.ciiva.com/15116/getdatasheetpartid-411031-15116193.pdf?src-supplier=Verical; ComponentLink1Description: https://datasheet.ciiva.com/15116/getdatasheetpartid-411031-15116193.pdf?src-supplier=Verical; ComponentLink2URL: https://datasheet.ciiva.com/6668/29337-6668309.pdf?src-supplier=Digi-Key; ComponentLink2Description: https://datasheet.ciiva.com/6668/29337-6668309.pdf?src-supplier=Digi-Key; ComponentLink3URL: https://datasheet.ciiva.com/6668/29337-6668312.pdf?src-supplier=Digi-Key; ComponentLink3Description: https://datasheet.ciiva.com/6668/29337-6668312.pdf?src-supplier=Digi-Key; ComponentLink4URL: https://datasheet.ciiva.com/6668/29337-6668316.pdf?src-supplier=Digi-Key; ComponentLink4Description: https://datasheet.ciiva.com/6668/29337-6668316.pdf?src-supplier=Digi-Key; ComponentLink5URL: http://datasheet.octopart.com/LTC6992IS6-1%23TRMPBF-Linear-Technology-datasheet-10978009.pdf?src-supplier=Linear+Technology; ComponentLink5Description: http://datasheet.octopart.com/LTC6992IS6-1%23TRMPBF-Linear-Technology-datasheet-10978009.pdf?src-supplier=Linear+Technology; ComponentLink6URL: http://sigma.octopart.com/57691988/technical_drawing/Linear-Technology-LTC6992IS6-1%23TRMPBF.pdf?src-supplier=Linear+Technology; ComponentLink6Description: http://sigma.octopart.com/57691988/technical_drawing/Linear-Technology-LTC6992IS6-1%23TRMPBF.pdf?src-supplier=Linear+Technology; Supplier Part Number 1: LTC6992IS6-1#TRMPBFCT-ND

## Sheet gate_driver.SchDoc
size A4; Author: Omri Nissan; Organization: Altium Limited; Address1: -; Address2: San Luis Obispo; Address3: California, 93401; Address4: United States; DocumentNumber: 7; SheetNumber: 7; SheetTotal: 8
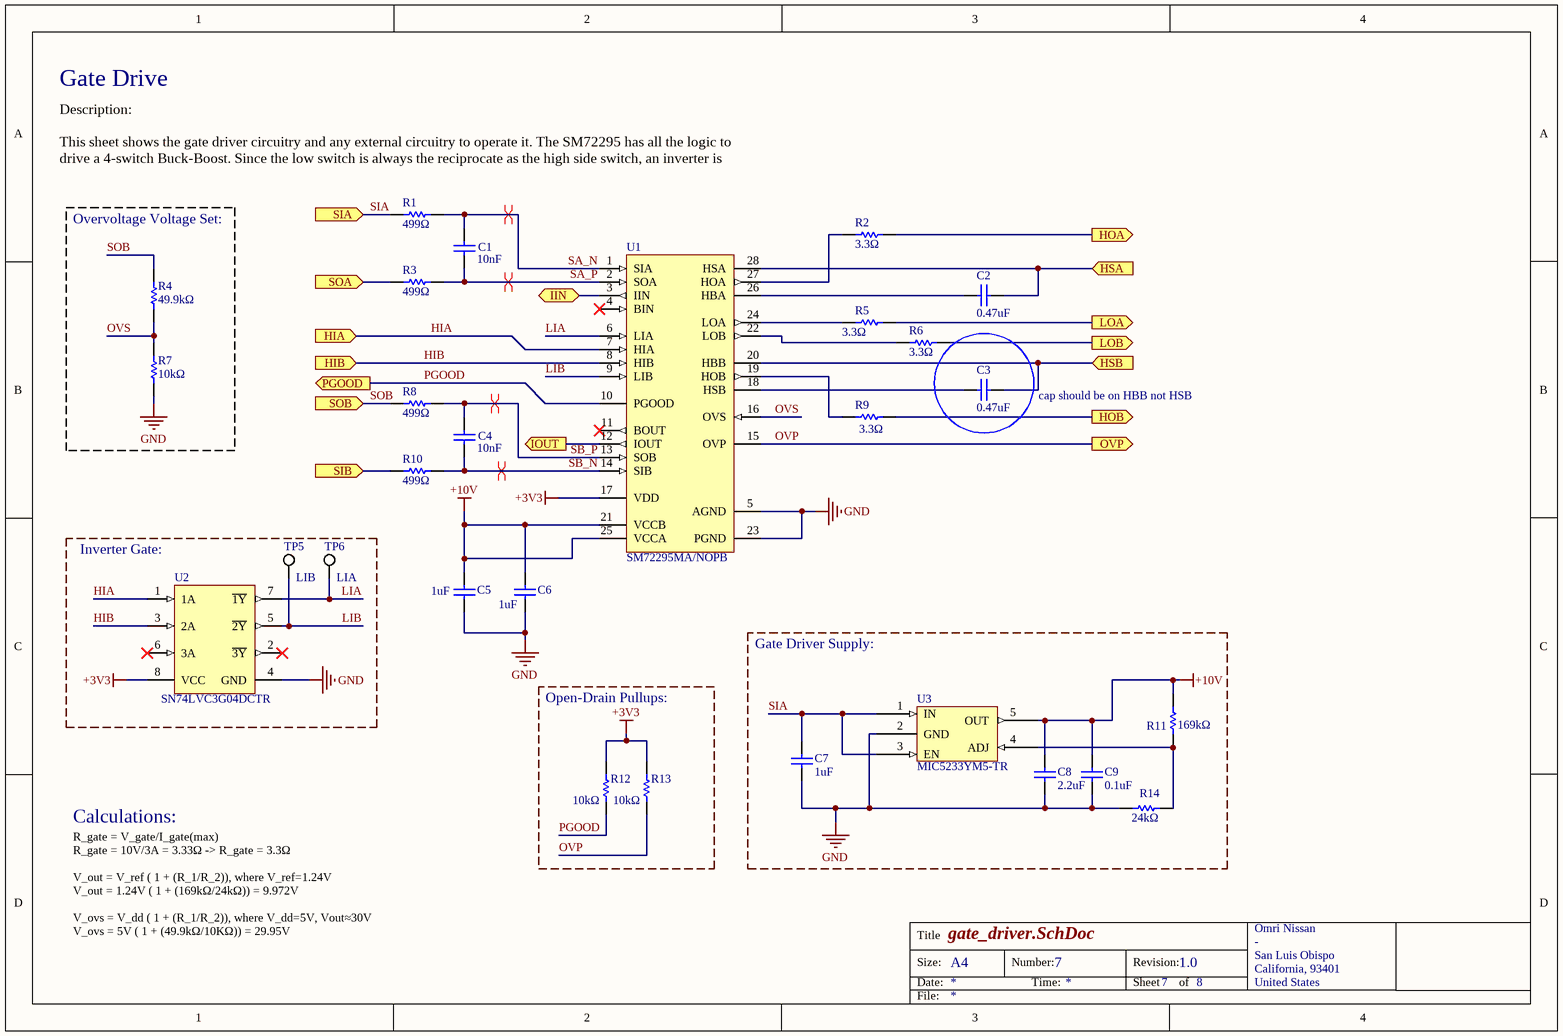
[diagram p5: gate_driver.SchDoc]

### Parts
C1  10nF  [CAPC1608X90X40ML10T20]
C2  0.47uF  [CAPC2013X110X50NL20T25]
C3  0.47uF  [CAPC2013X110X50NL20T25]
C4  10nF  [CAPC1608X90X40ML10T20]
C5  1uF  [CAPC1608X90X20LL10]
C6  1uF  [CAPC1608X90X20LL10]
C7  1uF  [CAPC1608X90X20LL10]
C8  2.2uF  [CAPC2013X145X20LL20]
C9  0.1uF  [CAPC1608X90X35ML10T15]
R1  499Ω  [RESC1608X55X30LL20T20]
R2  3.3Ω  [RESC1609X50X30LL10T20]
R3  499Ω  [RESC1608X55X30LL20T20]
R4  49.9kΩ  [RESC1608X55X30ML15T15]
R5  3.3Ω  [RESC1609X50X30LL10T20]
R6  3.3Ω  [RESC1609X50X30LL10T20]
R7  10kΩ  [RESC1609X55X30LL15T15]
R8  499Ω  [RESC1608X55X30LL20T20]
R9  3.3Ω  [RESC1609X50X30LL10T20]
R10  499Ω  [RESC1608X55X30LL20T20]
R11  169kΩ  [RESC1608X55X30ML15T15]
R12  10kΩ  [RESC1609X55X30LL15T15]
R13  10kΩ  [RESC1609X55X30LL15T15]
R14  24kΩ  [RESC1609X50X30NL10T20]
TP5  LIB  [KSTN-5012_V]
TP6  LIA  [KSTN-5012_V]
U1  SM72295MA/NOPB  [DW0028A_N]
U2  SN74LVC3G04DCTR  [TI-DCT8_V]
U3  MIC5233YM5-TR  [MF05A_L]

### Blocks framed on the sheet
Overvoltage Voltage Set:: R4 R7
Inverter Gate:: TP5 TP6 U2
Gate Driver Supply:: C7-C9 R11 R14 U3
Open-Drain Pullups:: R12 R13

### Ports
HIA (in), HIB (in), HOA (out), HOB (out), HSA (in), HSB (in), IIN (bidir), IOUT (out), LOA (out), LOB (out), OVP (out), PGOOD (out), SIA (in), SIB (in), SOA (in), SOB (in)

### Nets
+3V3: R12.2 R13.2 U1.17(VDD) U2.8(VCC)
+10V: C5.1 C6.1 C8.2 C9.2 R11.2 U1.21(VCCB) U1.25(VCCA) U3.5(OUT)
GND: C5.2 C6.2 C7.2 C8.1 C9.1 R7.1 R14.2 U1.5(AGND) U1.23(PGND) U2.4(GND) U3.2(GND)
HIA: U1.7(HIA) U2.1(1A) ; port HIA
HIB: U1.8(HIB) U2.3(2A) ; port HIB
LIA: TP6.1 U1.6(LIA) U2.7(~{1Y})
LIB: TP5.1 U1.9(LIB) U2.5(~{2Y})
OVP: R13.1 U1.15(OVP) ; port OVP
OVS: R4.1 R7.2 U1.16(OVS)
PGOOD: R12.1 U1.10(PGOOD) ; port PGOOD
SA_N: R3.1 ; port SOA
SA_N: C1.2 R1.2 U1.1(SIA)  [a separate net that carries the same name]
SA_P: C1.1 R3.2 U1.2(SOA)
SB_N: C4.1 R10.2 U1.14(SIB)
SB_P: R10.1 ; port SIB
SB_P: C4.2 R8.2 U1.13(SOB)  [a separate net that carries the same name]
SIA: C7.1 R1.1 U3.1(IN) U3.3(EN) ; port SIA  [project net SA_P]
SOB: R4.2 R8.1 ; port SOB  [project net +supply]
NetAD1_1: U1.3(IIN) ; port IIN
NetAD1_2: U1.12(IOUT) ; port IOUT
NetC2_1: C2.1 U1.26(HBA)
NetC2_2: C2.2 U1.28(HSA) ; port HSA
NetC3_1: C3.1 U1.18(HSB)
NetC3_2: C3.2 U1.20(HBB) ; port HSB
NetQ1_4: R2.2 ; port HOA
NetQ2_4: R9.2 ; port HOB
NetQ3_4: R5.2 ; port LOA
NetQ4_4: R6.2 ; port LOB
NetR2_1: R2.1 U1.27(HOA)
NetR5_1: R5.1 U1.24(LOA)
NetR6_1: R6.1 U1.22(LOB)
NetR9_1: R9.1 U1.19(HOB)
NetR11_1: R11.1 R14.1 U3.4(ADJ)

Not connected (* = marked no-connect by the designer): U1 4(BIN)* 11(BOUT)*; U2 2(~{3Y})* 6(3A)*

### Layout directives
differential pair: SA_N, SA_P, SB_N, SB_P

### Notes on the sheet
- Gate Drive
- Description:
  This sheet shows the gate driver circuitry and any external circuitry to operate it. The SM72295 has all the logic to drive a 4-switch Buck-Boost. Since the low switch is always the reciprocate as the high side switch, an inverter is used to drive the low side switches.
- (near C3) cap should be on HBB not HSB
- Calculations:
- R_gate = V_gate/I_gate(max)
  R_gate = 10V/3A = 3.33Ω -> R_gate = 3.3Ω
  V_out = V_ref ( 1 + (R_1/R_2)), where V_ref=1.24V
  V_out = 1.24V ( 1 + (169kΩ/24kΩ)) = 9.972V
  V_ovs = V_dd ( 1 + (R_1/R_2)), where V_dd=5V, Vout≈30V
  V_ovs = 5V ( 1 + (49.9kΩ/10KΩ)) = 29.95V
- Title
- Size:
- Date:
- A4
- Number:
- Time:
- Revision:
- Sheet
- of
- File:

### Library data of the parts
C1 C4 = CMP-2100-03600-1: CC0603KRX7R9BB103 - Chip Capacitor, 10 nF, +/- 10%, 50 V, -55 to 125 degC, 0603 (1608 Metric), RoHS, Tape and Reel; Manufacturer: Yageo; Insulation Resistance: 100GR; Dielectric: X7R; Voltage Rating (DC): 50V; Material: Ceramic; Lead Free: LeadFree; Case/Package: 0603; Datasheet Version: Rev. 15, 10/2016; Composition: Ceramic; Radiation Hardening: No; Thickness: 0.035inch; RoHSCompliant: True; Termination: SMD/SMT; Capacitance: 10nF; Manufacturer URL: http://www.yageo.com/; Tolerance: 10%; REACH SVHC: NoSVHC; Voltage: 50V; Max Operating Temperature: 125degC; Case Code (Metric): 1608; Package Quantity: 1; Case Code (Imperial): 0603; Packaging: TapeandReel; Package Reference: 0603; Width: 0.031inch; Datasheet URL: http://www.yageo.com/documents/recent/UPY-GPHC_X7R_6.3V-to-50V_15.pdf; Length: 1.6mm; Min Operating Temperature: -55degC; Number of Pins: 2; Depth: 0.8mm; Mount: SurfaceMount; Height: 0.8mm; Voltage Rating: 50V; Package Description: 2-Pin Surface Mount Device, Body 1.6 x 0.8 mm
C2 C3 = CMP-2007-03659-1: C0805C474K5RACTU; Manufacturer: Kemet; Part Number: C0805C474K5RACTU
C5-C7 = CMP-2000-06025-1: as C14 on sheet power_stage; Series: C; Datasheet Version: 08/2016; Package Description: 2-Pin Surface Mount Device, Body 1.6 x 0.8 mm; Mounting Technology: SurfaceMount; Features: -; Size / Dimension: 0.063"Lx0.031"W(1.60mmx0.80mm); Lead Spacing: -; Operating Temperature: -55°C~85°C; Tolerance: ±10%; Height - Seated (Max): -; Mounting Type: SurfaceMount,MLCC; Ratings: -; Standard Package: 1; Applications: GeneralPurpose; Datasheet URL: https://product.tdk.com/info/en/catalog/datasheets/mlcc_commercial_general_en.pdf; Category: Capacitors; Lead Style: -; Packaging: Digi-Reel®; RoHS Information: RoHSCertificate-MLCC; Package / Case: 0603(1608Metric); Package Reference: 0603; Manufacturer URL: http://www.tdk.com/; Thickness (Max): 0.035"(0.90mm); Family: CeramicCapacitors
C8 = CMP-2000-06040-1: C2012X7R1H225K125AC -Chip Capacitor, 2.2 uF, +/- 10%, 50 V, -55 to 125 degC, 0805 (2012 Metric), RoHS, Tape and Reel; Manufacturer: TDK; PCN Part Number: MLCCPartNumberChange30/Nov/2012; Other Names: 445-5968-1; Temperature Coefficient: X7R; Catalog Drawings: CSERIES_2012-0805_1.45; Kits: 445-9015-KIT-ND-KITMLCC1000PF-47UF080510-50V445-9003-KIT-ND-KITCAPCERHICAPMLCCSMD445-173086-KIT-ND-C0402-2220X7R6.3-50V1,000PF-; Online Catalog: CSeries,GeneralPurpose; Voltage - Rated: 50V; Capacitance: 2.2µF; Product Training Modules: CSeriesGeneralApplicationsSEAT,CCV,andTVCLDesignToolsGuidetoReplacinganElectrolyticCapacitorwithanMLCC; Operating Temperature: -55°C~125°C; Features: -; Tolerance: ±10%; Datasheet URL: https://datasheet.ciiva.com/24216/c2012x7r1h225k125ac-265016-24216364.pdf; Lead Style: -; Size / Dimension: 0.079"Lx0.049"W(2.00mmx1.25mm); Mounting Technology: SurfaceMount; Package Reference: 0805; Thickness (Max): 0.057"(1.45mm); RoHS Information: RoHSCertificate-MLCC; Height - Seated (Max): -; Manufacturer URL: http://www.tdk.com/; Standard Package: 1; Category: Capacitors; Package Description: 2-Pin Surface Mount Device, Body 2 x 1.25 mm; Packaging: CutTape(CT); Series: C; Applications: GeneralPurpose; Package / Case: 0805(2012Metric); Ratings: -; Datasheet Version: 09/2013; Family: CeramicCapacitors; Mounting Type: SurfaceMount,MLCC; Lead Spacing: -
C9 = CMP-2100-03643-1: as C10 on sheet power_stage; Case Code (Metric): 1608; Lead Free: LeadFree; Depth: 0.8mm; Number of Pins: 2; Radiation Hardening: No; Case/Package: 0603; Manufacturer URL: http://www.murata.com/; Packaging: TapeandReel; Length: 1.6mm; Contact Plating: Tin; Datasheet URL: http://psearch.en.murata.com/capacitor/product/GRM188R71H104KA93%23.pdf; Tolerance: 10%; Case Code (Imperial): 0603; Min Operating Temperature: -55degC; RoHSCompliant: true; Voltage: 50V; Termination: SMD/SMT; Mount: SurfaceMount; Material: Ceramic; Package Quantity: 1; Height: 0.8mm; Thickness: 0.035inch; REACH SVHC: NoSVHC; Max Operating Temperature: 125degC; Width: 0.8mm; Package Reference: 0603; Voltage Rating (DC): 50V; Datasheet Version: 42675.0; Package Description: 2-Pin Surface Mount Device, Body 1.6 x 0.8 mm
R1 R3 R8 R10 = CMP-2000-00076-1: ERA3AEB4990V; Manufacturer: Panasonic; Part Number: ERA3AEB4990V
R2 R5 R6 R9 = CMP-2000-03327-1: CRCW06033R30FNEA; Manufacturer: Vishay Dale; Part Number: CRCW06033R30FNEA
R4 = CMP-2000-00536-1: ERJ-3EKF4992V; Manufacturer: Panasonic; Part Number: ERJ-3EKF4992V
R7 R12 R13 = CMP-2000-07452-1: ERJ3EKF1002V - Chip Resistor, 10 KOhm, +/- 1%, 0.1 W, -55 to 155 degC, 0603 (1608 Metric), RoHS, Tape and Reel; Manufacturer: Panasonic; Voltage Rating: 75V; Case\/Package: 0603; Power Rating: 100mW; Resistance: 10KOhm; Temperature Coefficient: 100ppm\/degreesC; Number of Pins: 2; Package Reference: 603; Depth: 0.8mm; Mount: SurfaceMount; Package Description: 2-Pin Surface Mount Device, Body 1.6 x 0.85 mm; Datasheet Version: 02/2017; Length: 1.6mm; Lead Free: LeadFree; Height: 0.45mm; Number of Terminations: 2; Max Power Dissipation: 100mW; Min Operating Temperature: -55degC; Datasheet URL: https://industrial.panasonic.com/cdbs/www-data/pdf/RDA0000/AOA0000C304.pdf; Termination: SMD/SMT; Case Code (Metric): 1608; Case Code (Imperial): 0603; Tolerance: 1%; Max Operating Temperature: 155degC; RoHSCompliant: true; Voltage Rating (DC): 75V; Radiation Hardening: No; Packaging: TapeandReel; Composition: ThickFilm; Mounting Technology: SurfaceMount; Manufacturer URL: http://www.panasonic.com/; Width: 0.031inch; REACH SVHC: NoSVHC; Contact Plating: Tin; Military Standard: Not; Package Quantity: 1
R11 = CMP-2000-00284-1: ERJ-3EKF1693V; Manufacturer: Panasonic; Part Number: ERJ-3EKF1693V
R14 = CMP-2000-03118-1: CRCW060324K0FKEA; Manufacturer: Vishay Dale; Part Number: CRCW060324K0FKEA
TP5 TP6 = CMP-1672-00004-4: as TP7 on sheet power_stage; DatasheetVersion: Rev. F, 12/2013; ComponentLink1URL: http://www.keyelco.com/; PackageReference: 5012; RoHSCompliant: true; ComponentLink2Description: Datasheet; Colour: White; Contact Material: Bronze; PackageDescription: 1-Pin Through Hole Device, Dia 3.17 mm; Mounting Technology: Through Hole; Mount: Through Hole; Package Quantity: 100; ComponentLink1Description: Manufacturer URL; Pins: 1; Height: 8.12 mm; Packaging: Bulk; REACH SVHC: No SVHC; Contact Plating: Silver; Length: 11.3 mm; ComponentLink2URL: http://www.keyelco.com/product-pdf.cfm?p=1321
U1 = CMP-0058-01418-2: Photovoltaic Full Bridge Driver, 28-pin Wide SOIC, 26 Rail; Manufacturer: Texas Instruments; CompType: Interface IC; PackageTopMarking: NSUZXYTTE#*S72295; PowerWise: N; High-Reliability: Y; ComponentLink1Description: Datasheet URL; ComponentLink1URL: http://www.ti.com/general/docs/lit/getliterature.tsp?genericPartNumber=SM72295&fileType=pdf; PackageDescription: Molded Package, S.O., .300in Wide, 28 Lead; PinCount: 28; PartNumber: SM72295MA/NOPB; PackageReference: DW0028A; RoHS: Y
U2 = CMP-0859-00002-1: Triple Inverter Gate, 1.65 to 5.5 V, -40 to 125 degC, 8-Pin DCT, Green (RoHS & no Sb/Br), Tape and Reel; Manufacturer: Texas Instruments; VCC (Max): 5.5 V; tpd @ Nom Voltage (Max): 4.1 ns; ICC @ Nom Voltage (Max): 0.01 mA; F @ Nom Voltage (Max): 150 MHz; Bits: 3; VCC (Min): 1.65 V; PackageDescription: 8-Pin Plastic Small Outline, Body 2.95 x 2.8 mm, Pitch 0.65 mm; Mounting Technology: Surface Mount; ComponentLink2URL: http://www.ti.com/lit/ds/symlink/sn74lvc3g04.pdf; PartNumber: SN74LVC3G04DCTR; ComponentLink2Description: Datasheet; Packing: Tape and Reel; ComponentLink1URL: http://www.ti.com/; DatasheetVersion: SCES363L; ComponentLink1Description: Manufacturer URL; RoHS: TRUE; Operating Temperature Range: -40 to 125 degC; PackageReference: DCT-8
U3 = MIC5233YM5-TR_1: IC REG LDO ADJ .1A SOT23-5; Manufacturer 1: Microchip Micrel; Max Input Voltage: 36V; Min Input Voltage: 2.3V; Output Voltage: 20V; Output Type: Adjustable; Dropout Voltage: 270mV; Max Output Current: 100mA; Number of Outputs: 1; Min Output Voltage: 1.24V; Polarity: Positive; Output Voltage Accuracy: 1%; Supplier 1: Digi-Key; Manufacturer Part Number 1: MIC5233YM5-TR; Stock 1: 13352; Pricing 1: 1=1.20000, 25=1.00000, 100=0.91000 (USD); RoHS: Yes; Mount: Surface Mount; Case/Package: SOT-23; Number of Pins: 5; Min Operating Temperature: -40°C; Max Operating Temperature: 125°C; Packaging: Tape and Reel; Output Current: 100mA; Number of Regulators: 1; Max Output Voltage: 20V; Package Quantity: 1; Radiation Hardening: No; REACH SVHC: No SVHC; ComponentLink1URL: https://datasheet.ciiva.com/2044/mic5233-2044736.pdf?src-supplier=Digi-Key; ComponentLink1Description: https://datasheet.ciiva.com/2044/mic5233-2044736.pdf?src-supplier=Digi-Key; ComponentLink2URL: https://datasheet.ciiva.com/16374/mic5233-16374581.pdf?src-supplier=Future+Electronics; ComponentLink2Description: https://datasheet.ciiva.com/16374/mic5233-16374581.pdf?src-supplier=Future+Electronics; ComponentLink3URL: https://datasheet.ciiva.com/23773/1670787-23773077.pdf?src-supplier=Newark; ComponentLink3Description: https://datasheet.ciiva.com/23773/1670787-23773077.pdf?src-supplier=Newark; ComponentLink4URL: https://datasheet.ciiva.com/13026/mic5233-13026150.pdf?src-supplier=Mouser; ComponentLink4Description: https://datasheet.ciiva.com/13026/mic5233-13026150.pdf?src-supplier=Mouser; ComponentLink5URL: https://datasheet.ciiva.com/26890/getdatasheetpartid-111208-26890058.pdf?src-supplier=Verical; ComponentLink5Description: https://datasheet.ciiva.com/26890/getdatasheetpartid-111208-26890058.pdf?src-supplier=Verical; ComponentLink6URL: https://datasheet.ciiva.com/2044/mic5233-2044734.pdf?src-supplier=Digi-Key; ComponentLink6Description: https://datasheet.ciiva.com/2044/mic5233-2044734.pdf?src-supplier=Digi-Key; ComponentLink7URL: https://datasheet.ciiva.com/7993/1670787-7993422.pdf?src-supplier=Element14; ComponentLink7Description: https://datasheet.ciiva.com/7993/1670787-7993422.pdf?src-supplier=Element14; ComponentLink8URL: https://datasheet.ciiva.com/2044/mic5233-2044735.pdf?src-supplier=Digi-Key; ComponentLink8Description: https://datasheet.ciiva.com/2044/mic5233-2044735.pdf?src-supplier=Digi-Key; ComponentLink9URL: https://datasheet.ciiva.com/23772/1670787-23772959.pdf?src-supplier=Newark; ComponentLink9Description: https://datasheet.ciiva.com/23772/1670787-23772959.pdf?src-supplier=Newark; Supplier Part Number 1: 576-1507-1-ND

## Sheet dac.SchDoc
size A4; Author: Omri Nissan; Organization: Altium Limited; Address1: -; Address2: San Luis Obispo; Address3: California, 93401; Address4: United States
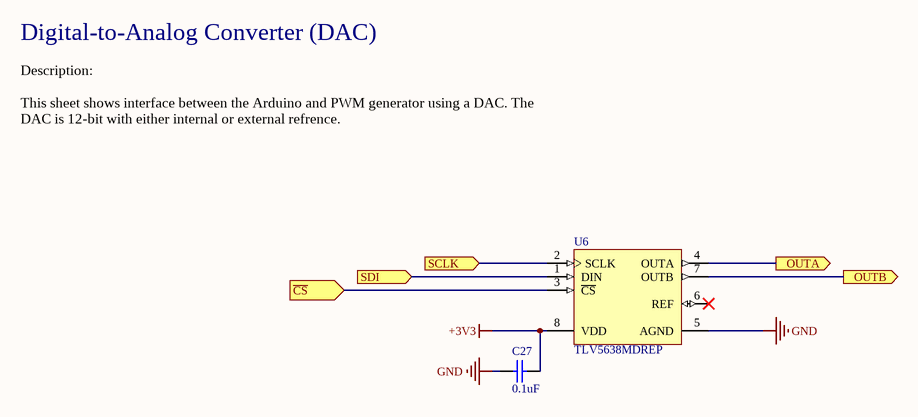
[diagram p6: dac.SchDoc]

### Parts
C27  0.1uF  [CAPC1608X90X35ML10T15]
U6  TLV5638MDREP  [TI-D8_M]

### Ports
OUTA (out), OUTB (out), SCLK (in), SDI (in), ~{CS} (in)

### Nets
+3V3: C27.1 U6.8(VDD)
GND: C27.2 U6.5(AGND)
MOSI: U6.1(DIN) ; port SDI
SCK: U6.2(SCLK) ; port SCLK
NetIOH1_3: U6.3(~{CS}) ; port ~{CS}
NetTP17_PWM_Generator1_1: U6.7(OUTB) ; port OUTB
NetTP17_PWM_Generator2_1: U6.4(OUTA) ; port OUTA

Not connected (* = marked no-connect by the designer): U6 6(REF)*

### Notes on the sheet
- Digital-to-Analog Converter (DAC)
- Description:
  This sheet shows interface between the Arduino and PWM generator using a DAC. The DAC is 12-bit with either internal or external refrence.
- Title
- Size:
- Date:
- A4
- Number:
- Time:
- Revision:
- Sheet
- of
- File:

### Library data of the parts
C27 = CMP-2100-03643-1: as C10 on sheet power_stage; Case Code (Metric): 1608; Lead Free: LeadFree; Depth: 0.8mm; Number of Pins: 2; Radiation Hardening: No; Case/Package: 0603; Manufacturer URL: http://www.murata.com/; Packaging: TapeandReel; Length: 1.6mm; Contact Plating: Tin; Datasheet URL: http://psearch.en.murata.com/capacitor/product/GRM188R71H104KA93%23.pdf; Tolerance: 10%; Case Code (Imperial): 0603; Min Operating Temperature: -55degC; RoHSCompliant: true; Voltage: 50V; Termination: SMD/SMT; Mount: SurfaceMount; Material: Ceramic; Package Quantity: 1; Height: 0.8mm; Thickness: 0.035inch; REACH SVHC: NoSVHC; Max Operating Temperature: 125degC; Width: 0.8mm; Package Reference: 0603; Voltage Rating (DC): 50V; Datasheet Version: 42675.0; Package Description: 2-Pin Surface Mount Device, Body 1.6 x 0.8 mm
U6 = CMP-0004-00179-1: Enhanced Product 12-Bit, 1 us Serial Input Dual DAC, Programmable Internal Reference, Settling Time, -55 to 125 degC, 8-pin SOIC (D8), Green (RoHS & no Sb/Br); Manufacturer: Texas Instruments; INL(Max)(+/-LSB): 6; DAC Channels: 2; DNL(Max)(+/-LSB): 1; Interface: Serial SPI; SubFamily: Precision DAC (=<10MSPS); Resolution(Bits): 12; SFDR(dB): 72; Power Consumption(Typ)(mW): 4.5; SNR(dB): 74; PackageVersion: 4040047-3/M, 06/2011; DatasheetVersion: SGLS130B; ComponentLink2Description: Datasheet; ComponentLink3URL: http://www.ti.com/litv/pdf/msoi002j; ComponentLink3Description: Package Specification; Mounting Technology: Surface Mount; PackageDescription: 8-Pin Plastic Small Outline, Body 4.9 x 3.9 mm, Pitch 1.27 mm; Settling Time(us): 1; Code_JEDEC: MS-012; ComponentLink2URL: http://www.ti.com/general/docs/lit/getliterature.tsp?genericPartNumber=TLV5638-EP&fileType=pdf; PartNumber: TLV5638MDREP; PackageReference: D8; ComponentLink1Description: Manufacturer URL; Eco-Plan: Green (RoHS & no Sb/Br); ComponentLink1URL: http://www.ti.com/

## Sheet cover_page.SchDoc
size A4; Author: Omri Nissan; Organization: Altium Limited; Address1: -; Address2: San Luis Obispo; Address3: California, 93401; Address4: United States; DocumentNumber: 1; SheetNumber: 1; SheetTotal: 8

### Notes on the sheet
- Title
- Size:
- Date:
- A4
- Number:
- Time:
- Revision:
- Sheet
- of
- File: